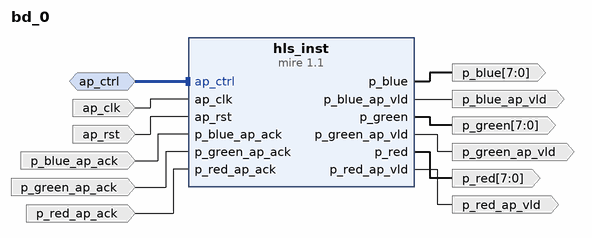
[diagram p0: block diagram of the top level]
# Vivado block design bd_0, xc7z020clg484-1, Vivado 2019.2
create_bd_design bd_0

create_bd_intf_port -mode Slave -vlnv xilinx.com:interface:acc_handshake_rtl:1.0 ap_ctrl
create_bd_port -dir I -type clk ap_clk
set_property -dict {CONFIG.FREQ_HZ 100000000.0} [get_bd_ports ap_clk]
create_bd_port -dir I -type rst ap_rst
set_property -dict {CONFIG.POLARITY ACTIVE_HIGH} [get_bd_ports ap_rst]
create_bd_port -dir O -from 7 -to 0 -type data p_blue
create_bd_port -dir I p_blue_ap_ack
create_bd_port -dir O p_blue_ap_vld
create_bd_port -dir O -from 7 -to 0 -type data p_green
create_bd_port -dir I p_green_ap_ack
create_bd_port -dir O p_green_ap_vld
create_bd_port -dir O -from 7 -to 0 -type data p_red
create_bd_port -dir I p_red_ap_ack
create_bd_port -dir O p_red_ap_vld

create_bd_cell -type ip -vlnv xilinx.com:hls:mire:1.1 hls_inst

# ---- connections ----

connect_bd_intf_net -intf_net ap_ctrl_0_1 [get_bd_intf_ports ap_ctrl] [get_bd_intf_pins hls_inst/ap_ctrl]
connect_bd_net -net ap_clk_0_1 [get_bd_ports ap_clk] [get_bd_pins hls_inst/ap_clk]
connect_bd_net -net ap_rst_0_1 [get_bd_ports ap_rst] [get_bd_pins hls_inst/ap_rst]
connect_bd_net [get_bd_pins hls_inst/p_blue] [get_bd_ports p_blue]
connect_bd_net -net p_blue_ap_ack_0_1 [get_bd_ports p_blue_ap_ack] [get_bd_pins hls_inst/p_blue_ap_ack]
connect_bd_net [get_bd_pins hls_inst/p_blue_ap_vld] [get_bd_ports p_blue_ap_vld]
connect_bd_net [get_bd_pins hls_inst/p_green] [get_bd_ports p_green]
connect_bd_net -net p_green_ap_ack_0_1 [get_bd_ports p_green_ap_ack] [get_bd_pins hls_inst/p_green_ap_ack]
connect_bd_net [get_bd_pins hls_inst/p_green_ap_vld] [get_bd_ports p_green_ap_vld]
connect_bd_net [get_bd_pins hls_inst/p_red] [get_bd_ports p_red]
connect_bd_net -net p_red_ap_ack_0_1 [get_bd_ports p_red_ap_ack] [get_bd_pins hls_inst/p_red_ap_ack]
connect_bd_net [get_bd_pins hls_inst/p_red_ap_vld] [get_bd_ports p_red_ap_vld]

validate_bd_design
save_bd_design
